# EAGLE schematic dots (EAGLE 6.1)
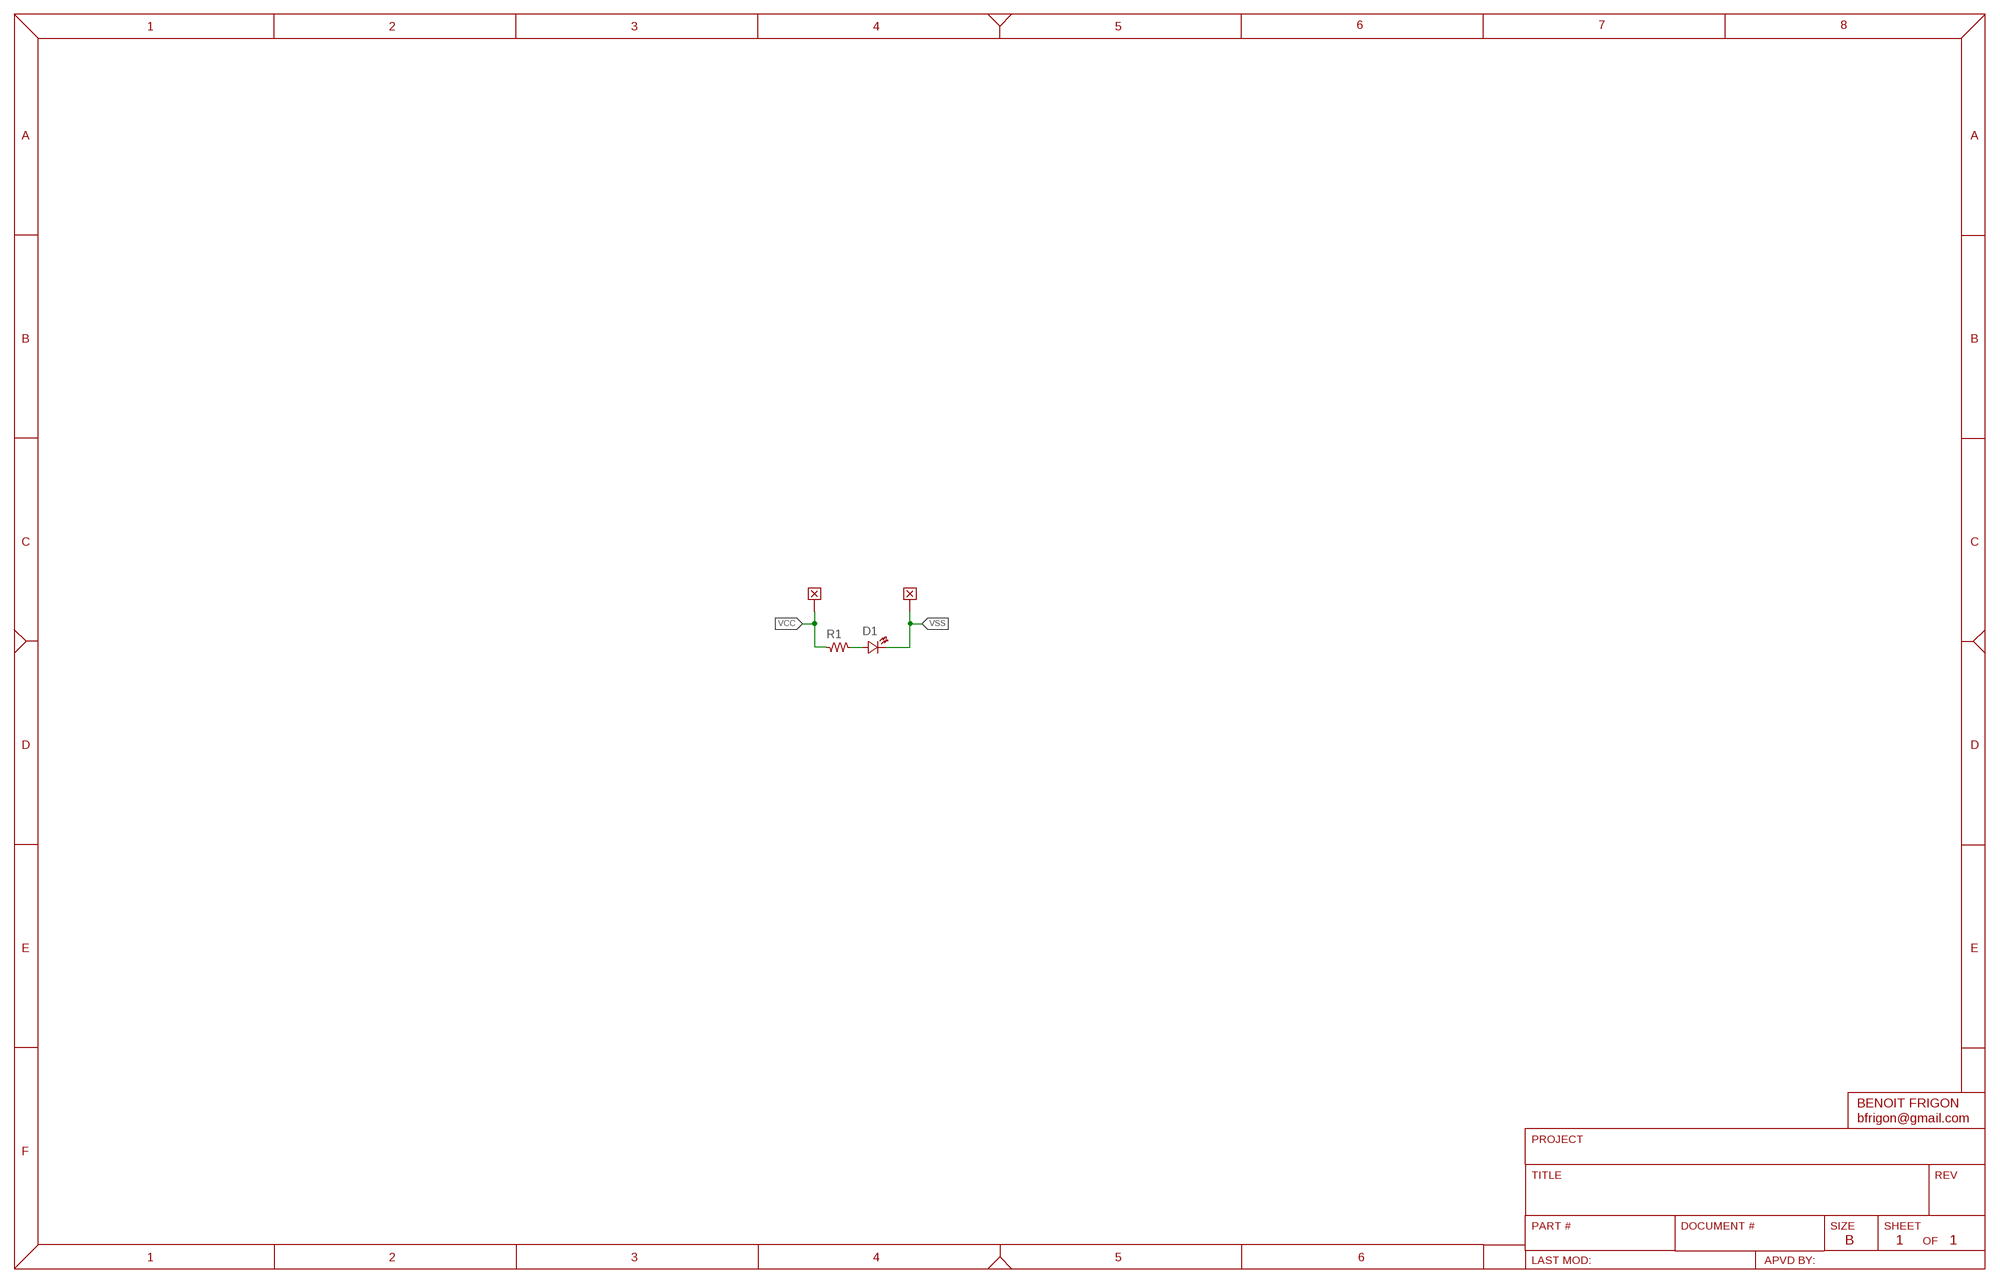
[diagram p0: schematic, sheet 1]

## Parts
D1  {ATTR:COLOR}  LED-0805  [CHIPLED_0805]
R1  RES-0603  [SMD_0603]
W1  WIRE  [WIRE_SMT]
W2  WIRE  [WIRE_SMT]

## Nets
N$2: D1.A R1.2
VCC: R1.1 W1.1
VSS: D1.K W2.1

## Library data of the parts
D1 = Optoelectronic:LED: Led; COLOR: Green; DESCRIPTION: {DESCRIPTION} Chip 0805 - {ATTR:COLOR}; PACKAGE: SMT 0805; SKU: -
R1 = Passive:RES: Resistor; DESCRIPTION: {DESCRIPTION} - SMT 0603 - {VALUE}; PACKAGE: SMT 0603
W1 W2 = Misc:WIRE